# Altium schematic sheet Reefing-BM.SchDoc: Reefing System
size A4; DocumentNumber: Subtitle; Revision: V1.0; SheetNumber: 3; SheetTotal: 13; Author: Luca Jost; Subtitle: Battery Management
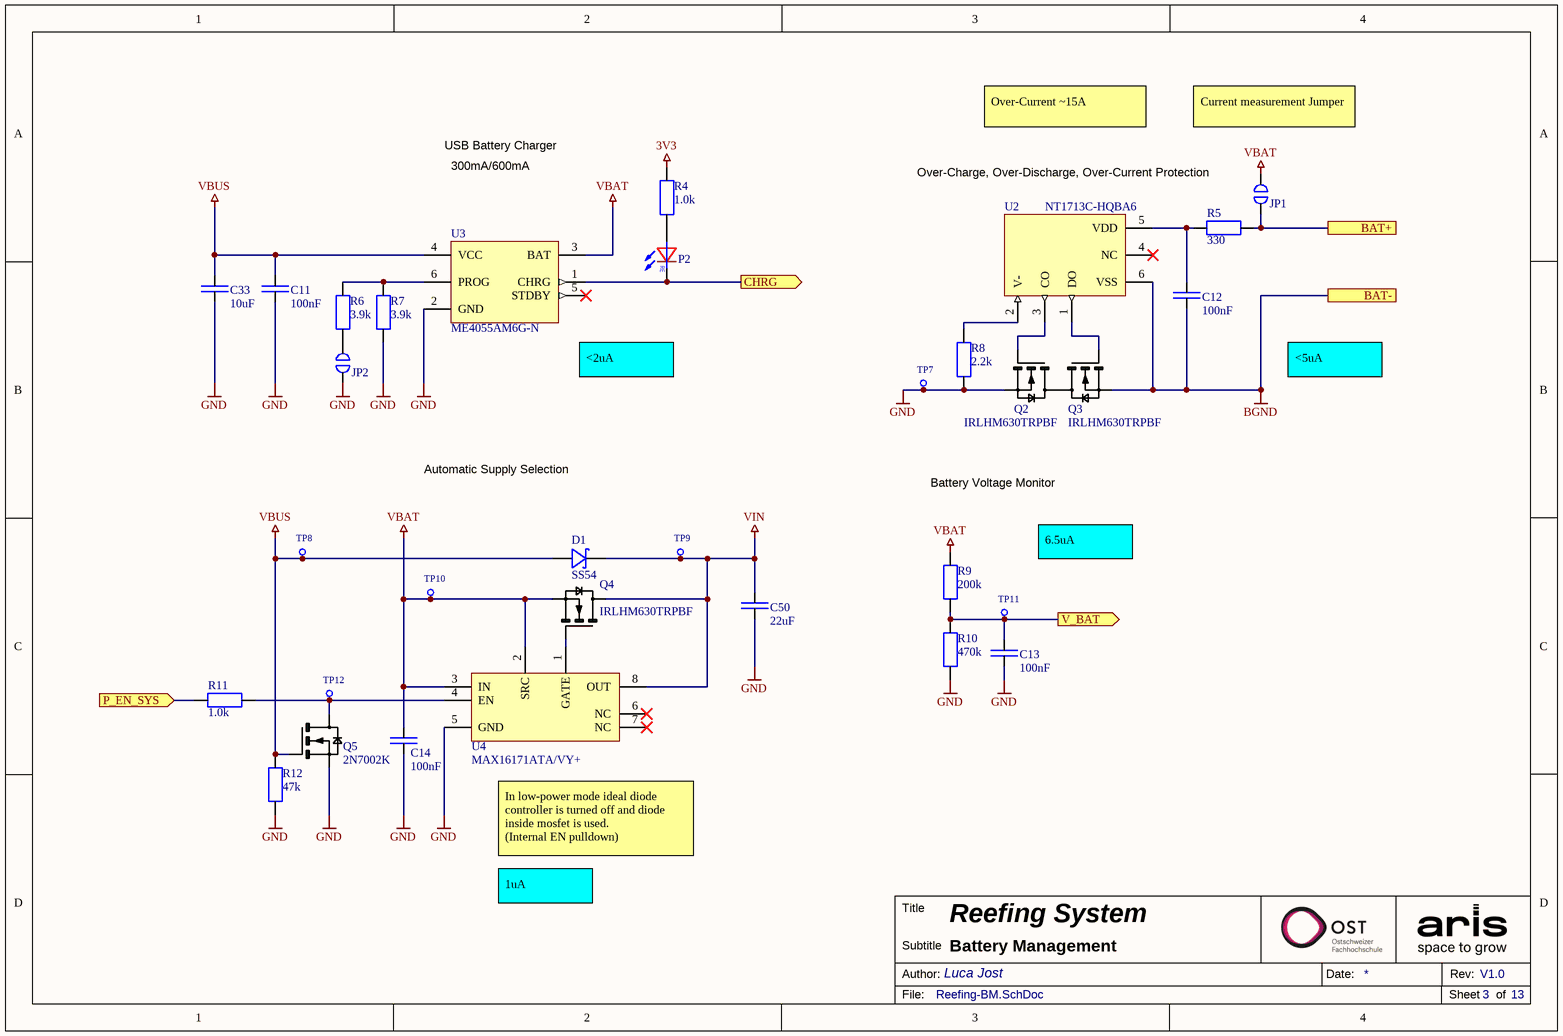
[diagram p0: Reefing-BM.SchDoc]

## Parts
C11  100nF  [SMD Keramikkondensator 0402]
C12  100nF  [SMD Keramikkondensator 0402]
C13  100nF  [SMD Keramikkondensator 0402]
C14  100nF  [SMD Keramikkondensator 0402]
C33  10uF  [SMD Keramikkondensator 0603]
C50  22uF  [SMD Keramikkondensator 0805]
D1  SS54  [SMD Diode DO-214-AC]
JP1  Jumper  [SMD Solder Jumper 1x2mm]  (value not drawn)  (no BOM)
JP2  Jumper  [SMD Solder Jumper 1x2mm]  (value not drawn)  (no BOM)
P2  LED  [SMD LED 0603]  (value not drawn)
Q2  IRLHM630TRPBF  [SMD MOSFET DFN 3.3x3.3]
Q3  IRLHM630TRPBF  [SMD MOSFET DFN 3.3x3.3]
Q4  IRLHM630TRPBF  [SMD MOSFET DFN 3.3x3.3]
Q5  2N7002K  [SMD MOSFET SOT-23]
R4  1.0k  [SMD Widerstand 0402]
R5  330  [SMD Widerstand 0402]
R6  3.9k  [SMD Widerstand 0402]
R7  3.9k  [SMD Widerstand 0402]
R8  2.2k  [SMD Widerstand 0402]
R9  200k  [SMD Widerstand 0402]
R10  470k  [SMD Widerstand 0402]
R11  1.0k  [SMD Widerstand 0402]
R12  47k  [SMD Widerstand 0402]
TP7  X-TP  [SMD Testpoint 1mm]  (value not drawn)  (no BOM)
TP8  X-TP  [SMD Testpoint 1mm]  (value not drawn)  (no BOM)
TP9  X-TP  [SMD Testpoint 1mm]  (value not drawn)  (no BOM)
TP10  X-TP  [SMD Testpoint 1mm]  (value not drawn)  (no BOM)
TP11  X-TP  [SMD Testpoint 1mm]  (value not drawn)  (no BOM)
TP12  X-TP  [SMD Testpoint 1mm]  (value not drawn)  (no BOM)
U2  NT1713C-HQBA6  [SMD IC SOT-23-6]
U3  ME4055AM6G-N  [SMD IC SOT-23-6]
U4  MAX16171ATA/VY+  [SMD IC TDFN-8]

## Ports
BAT+, BAT-, CHRG (out), P_EN_SYS (in), V_BAT (out)

## Nets
3V3: R4.2
BGND: C12.1 Q3.S U2.6(VSS) ; port BAT-
GND: C11.1 C13.1 C14.1 C33.1 C50.1 JP2.2 Q2.S Q5.S R7.1 R8.1 R10.1 R12.1 TP7.1 U3.2(GND) U4.5(GND)
VBAT: C14.2 JP1.1 Q4.S R9.2 TP10.1 U3.3(BAT) U4.2(SRC) U4.3(IN)
VBUS: C11.2 C33.2 D1.A Q5.G R12.2 TP8.1 U3.4(VCC)
VIN: C50.2 D1.K Q4.D TP9.1 U4.8(OUT)
BAT+: JP1.2 R5.1 ; port BAT+
CHRG: P2.K U3.1(CHRG) ; port CHRG
P_EN_SYS: R11.2 ; port P_EN_SYS
V_BAT: C13.2 R9.1 R10.2 TP11.1 ; port V_BAT
NetC12_2: C12.2 R5.2 U2.5(VDD)
NetJP2_1: JP2.1 R6.1
NetP2_A: P2.A R4.1
NetQ2_D: Q2.D Q3.D
NetQ2_G: Q2.G U2.3(CO)
NetQ3_G: Q3.G U2.1(DO)
NetQ4_G: Q4.G U4.1(GATE)
NetQ5_D: Q5.D R11.1 TP12.1 U4.4(EN)
NetR6_2: R6.2 R7.2 U3.6(PROG)
NetR8_2: R8.2 U2.2(V-)

Not connected (* = marked no-connect by the designer): U2 4(NC)*; U3 5(STDBY)*; U4 6(NC)* 7(NC)*

## Notes on the sheet
- USB Battery Charger
- 300mA/600mA
- (near JP1) Over-Charge, Over-Discharge, Over-Current Protection
- Over-Current ~15A
- Current measurement Jumper
- (near U3) <2uA
- <5uA
- Automatic Supply Selection
- Battery Voltage Monitor
- 6.5uA
- In low-power mode ideal diode controller is turned off and diode inside mosfet is used.
  (Internal EN pulldown)
- 1uA
- Title
- Author:
- Subtitle
- Date:
- Rev:
- File:
- Sheet
- of
- (in symbol LED) RE

## Library data of the parts
C11-C14 = E6 - 100nF: SMD Ceramic Capacitor E6; Unit Price: 0.01; JLC: C307331
C33 = E6 - 10uF: SMD Ceramic Capacitor E6; Unit Price: 0.01; JLC: C70225
C50 = E6 - 22uF: SMD Ceramic Capacitor E6; Unit Price: 0.01; JLC: C45783
D1 = SS54: 40V 5A 550mV @ 5A SMA(DO-214AC) Schottky Barrier Diodes (SBD) ROHS; ComponentLink1Description: Datasheet; ComponentLink1URL: https://datasheet.lcsc.com/lcsc/1810192041_MDD%EF%BC%88Microdiode-Electronics%EF%BC%89-SS54_C22452.pdf; JLC: C22452; Unit Price: 0.07
JP1 JP2 = Jumper-1: Single Position Jumper; Unit Price: 0.00
P2 = LED: Color LED; JLC: C2286
Q2-Q4 = IRLHM630TRPBF: N-Channel 30V 21A 3.5mOhm@4.5V; JLC: C148139; ComponentLink1Description: Datasheet; ComponentLink1URL: https://datasheet.lcsc.com/lcsc/1808281623_Infineon-Technologies-IRLHM630TRPBF_C148139.pdf; Unit Price: 0.76
Q5 = 2N7002K: MOSFET N-Channel 60V / 500mA; Digikey: 2N7002NCT-ND; ComponentLink1Description: Datasheet; ComponentLink1URL: https://www.onsemi.com/pub/Collateral/NDS7002A-D.PDF; JLC: C414015; Unit Price: 0.32
R4 R11 = E24 - 1.0k: SMD Chip Resistor E24; Unit Price: 0.01; JLC: C11702
R5 = E24 - 330: SMD Chip Resistor E24; Unit Price: 0.01; JLC: C25104
R6 R7 = E24 - 3.9k: SMD Chip Resistor E24; Unit Price: 0.01; JLC: C51721
R8 = E24 - 2.2k: SMD Chip Resistor E24; Unit Price: 0.01; Number: -; Supplier: -; JLC: C25879
R9 = E24 - 200k: SMD Chip Resistor E24; Unit Price: 0.01; JLC: C25764
R10 = E24 - 470k: SMD Chip Resistor E24; Unit Price: 0.01; JLC: C25790
R12 = E24 - 47k: SMD Chip Resistor E24; Unit Price: 0.01; JLC: C25792
TP7-TP12 = X-TP: Testpunkt; Unit Price: 0.00
U2 = NT1713C-HQBA6: Protection IC for 1-Cell Battery Pack; JLC: C596363; ComponentLink1Description: Datasheet; ComponentLink1URL: https://datasheet.lcsc.com/lcsc/2006171818_NEOTEC-NT1713C-HQBA6_C596363.pdf; Unit Price: 0.07
U3 = ME4055AM6G-N: 800mA Lithium Ion Battery Linear Charger; ComponentLink1Description: Datasheet; ComponentLink1URL: https://datasheet.lcsc.com/lcsc/1809291612_MICRONE-Nanjing-Micro-One-Elec-ME4055AM6G-N_C82121.pdf; JLC: C82121; Unit Price: 0.10
U4 = MAX16171ATA/VY+: OR Controller N+1 ORing Controller N-Channel 1:1 8-TDFN-CU (2x3); ComponentLink1Description: Datasheet; ComponentLink1URL: https://datasheets.maximintegrated.com/en/ds/MAX16171.pdf; Digikey: 175-MAX16171ATA/VY+-ND; Unit Price: 2.14